# Altium project New_SSA.PrjPcb
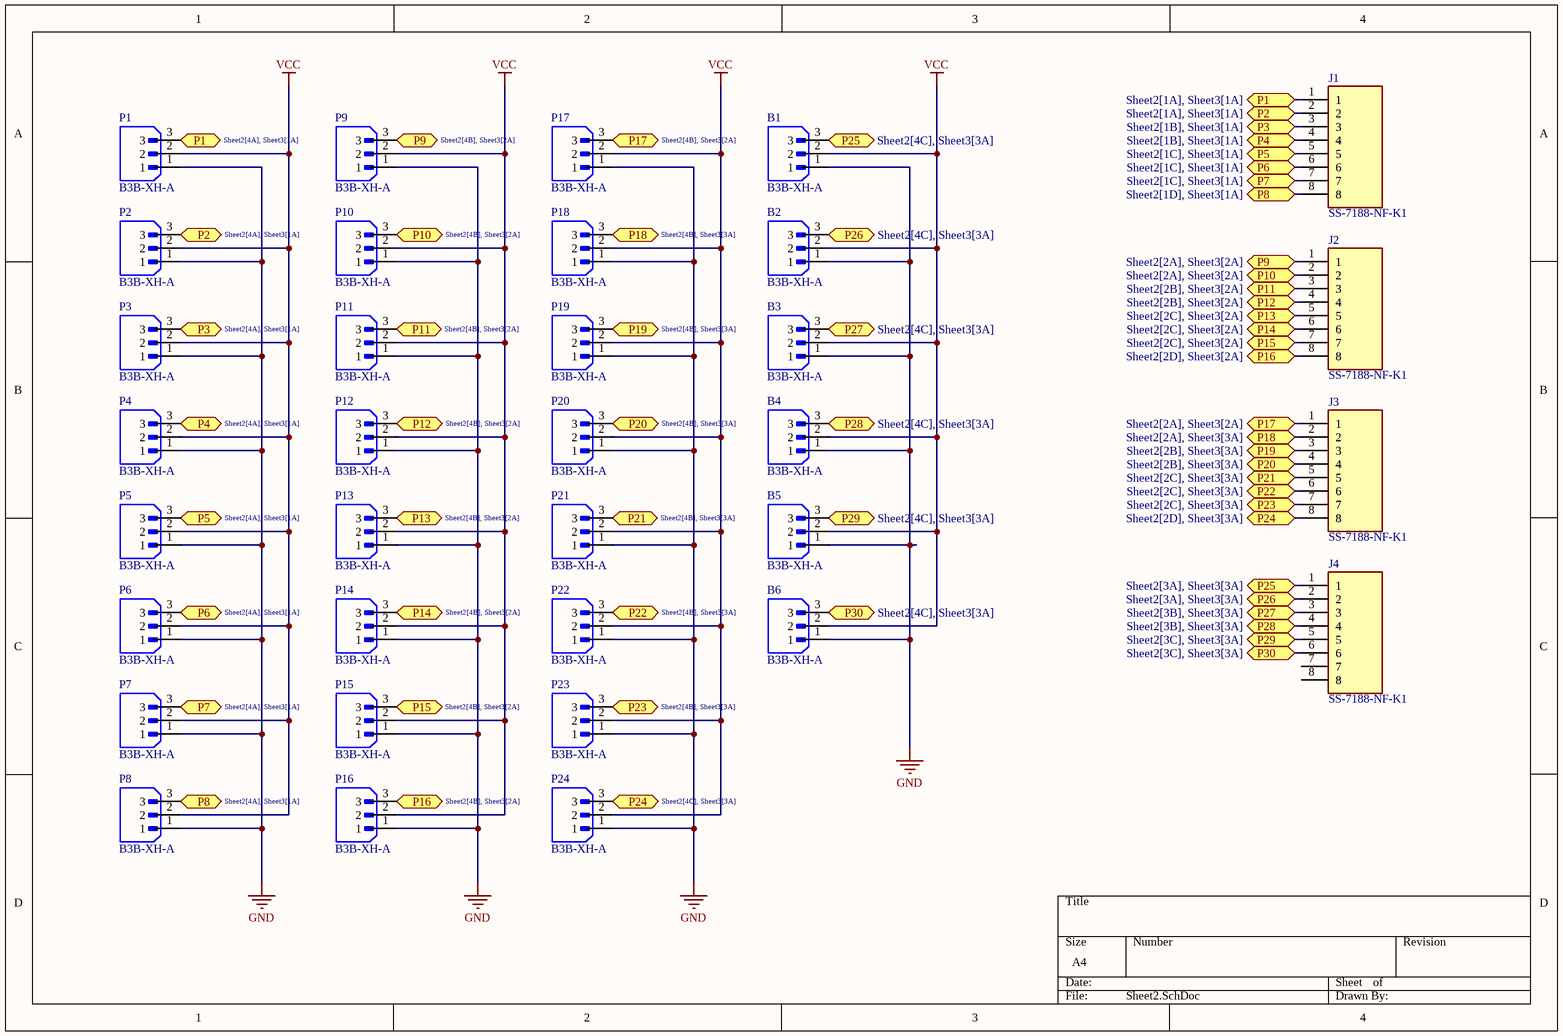
[diagram p0: Sheet2.SchDoc]
2 sheets, 40 parts. Net scope: flat (ports and power ports of the same name join across sheets).
Board file: PCB4.PcbDoc
Sheets:
  Sheet2.SchDoc
  Sheet3.SchDoc

## Sheet Sheet2.SchDoc
size A4; SheetNumber: 1; SheetTotal: 2

### Parts
B1  B3B-XH-A  [JST_B3B-XH-A]
B2  B3B-XH-A  [JST_B3B-XH-A]
B3  B3B-XH-A  [JST_B3B-XH-A]
B4  B3B-XH-A  [JST_B3B-XH-A]
B5  B3B-XH-A  [JST_B3B-XH-A]
B6  B3B-XH-A  [JST_B3B-XH-A]
J1  SS-7188-NF-K1  [BEL_SS-7188-NF-K1]
J2  SS-7188-NF-K1  [BEL_SS-7188-NF-K1]
J3  SS-7188-NF-K1  [BEL_SS-7188-NF-K1]
J4  SS-7188-NF-K1  [BEL_SS-7188-NF-K1]
P1  B3B-XH-A  [JST_B3B-XH-A]
P2  B3B-XH-A  [JST_B3B-XH-A]
P3  B3B-XH-A  [JST_B3B-XH-A]
P4  B3B-XH-A  [JST_B3B-XH-A]
P5  B3B-XH-A  [JST_B3B-XH-A]
P6  B3B-XH-A  [JST_B3B-XH-A]
P7  B3B-XH-A  [JST_B3B-XH-A]
P8  B3B-XH-A  [JST_B3B-XH-A]
P9  B3B-XH-A  [JST_B3B-XH-A]
P10  B3B-XH-A  [JST_B3B-XH-A]
P11  B3B-XH-A  [JST_B3B-XH-A]
P12  B3B-XH-A  [JST_B3B-XH-A]
P13  B3B-XH-A  [JST_B3B-XH-A]
P14  B3B-XH-A  [JST_B3B-XH-A]
P15  B3B-XH-A  [JST_B3B-XH-A]
P16  B3B-XH-A  [JST_B3B-XH-A]
P17  B3B-XH-A  [JST_B3B-XH-A]
P18  B3B-XH-A  [JST_B3B-XH-A]
P19  B3B-XH-A  [JST_B3B-XH-A]
P20  B3B-XH-A  [JST_B3B-XH-A]
P21  B3B-XH-A  [JST_B3B-XH-A]
P22  B3B-XH-A  [JST_B3B-XH-A]
P23  B3B-XH-A  [JST_B3B-XH-A]
P24  B3B-XH-A  [JST_B3B-XH-A]

### Ports
P1 (bidir, see Sheet2[1A], Sheet3[1A]), P1 (bidir, see Sheet2[4A], Sheet3[1A]), P2 (bidir, see Sheet2[1A], Sheet3[1A]), P2 (bidir, see Sheet2[4A], Sheet3[1A]), P3 (bidir, see Sheet2[1B], Sheet3[1A]), P3 (bidir, see Sheet2[4A], Sheet3[1A]), P4 (bidir, see Sheet2[1B], Sheet3[1A]), P4 (bidir, see Sheet2[4A], Sheet3[1A]), P5 (bidir, see Sheet2[1C], Sheet3[1A]), P5 (bidir, see Sheet2[4A], Sheet3[1A]), P6 (bidir, see Sheet2[1C], Sheet3[1A]), P6 (bidir, see Sheet2[4A], Sheet3[1A]), P7 (bidir, see Sheet2[1C], Sheet3[1A]), P7 (bidir, see Sheet2[4A], Sheet3[1A]), P8 (bidir, see Sheet2[1D], Sheet3[1A]), P8 (bidir, see Sheet2[4A], Sheet3[1A]), P9 (bidir, see Sheet2[2A], Sheet3[2A]), P9 (bidir, see Sheet2[4B], Sheet3[2A]), P10 (bidir, see Sheet2[2A], Sheet3[2A]), P10 (bidir, see Sheet2[4B], Sheet3[2A]), P11 (bidir, see Sheet2[2B], Sheet3[2A]), P11 (bidir, see Sheet2[4B], Sheet3[2A]), P12 (bidir, see Sheet2[2B], Sheet3[2A]), P12 (bidir, see Sheet2[4B], Sheet3[2A]), P13 (bidir, see Sheet2[2C], Sheet3[2A]), P13 (bidir, see Sheet2[4B], Sheet3[2A]), P14 (bidir, see Sheet2[2C], Sheet3[2A]), P14 (bidir, see Sheet2[4B], Sheet3[2A]), P15 (bidir, see Sheet2[2C], Sheet3[2A]), P15 (bidir, see Sheet2[4B], Sheet3[2A]), P16 (bidir, see Sheet2[2D], Sheet3[2A]), P16 (bidir, see Sheet2[4B], Sheet3[2A]), P17 (bidir, see Sheet2[2A], Sheet3[2A]), P17 (bidir, see Sheet2[4B], Sheet3[2A]), P18 (bidir, see Sheet2[2A], Sheet3[3A]), P18 (bidir, see Sheet2[4B], Sheet3[3A]), P19 (bidir, see Sheet2[2B], Sheet3[3A]), P19 (bidir, see Sheet2[4B], Sheet3[3A]), P20 (bidir, see Sheet2[2B], Sheet3[3A]), P20 (bidir, see Sheet2[4B], Sheet3[3A]), P21 (bidir, see Sheet2[2C], Sheet3[3A]), P21 (bidir, see Sheet2[4B], Sheet3[3A]), P22 (bidir, see Sheet2[2C], Sheet3[3A]), P22 (bidir, see Sheet2[4B], Sheet3[3A]), P23 (bidir, see Sheet2[2C], Sheet3[3A]), P23 (bidir, see Sheet2[4B], Sheet3[3A]), P24 (bidir, see Sheet2[2D], Sheet3[3A]), P24 (bidir, see Sheet2[4C], Sheet3[3A]), P25 (bidir, see Sheet2[3A], Sheet3[3A]), P25 (bidir, see Sheet2[4C], Sheet3[3A]), P26 (bidir, see Sheet2[3A], Sheet3[3A]), P26 (bidir, see Sheet2[4C], Sheet3[3A]), P27 (bidir, see Sheet2[3B], Sheet3[3A]), P27 (bidir, see Sheet2[4C], Sheet3[3A]), P28 (bidir, see Sheet2[3B], Sheet3[3A]), P28 (bidir, see Sheet2[4C], Sheet3[3A]), P29 (bidir, see Sheet2[3C], Sheet3[3A]), P29 (bidir, see Sheet2[4C], Sheet3[3A]), P30 (bidir, see Sheet2[3C], Sheet3[3A]), P30 (bidir, see Sheet2[4C], Sheet3[3A])

### Nets
GND: B1.1 B2.1 B3.1 B4.1 B5.1 B6.1 P1.1 P2.1 P3.1 P4.1 P5.1 P6.1 P7.1 P8.1 P9.1 P10.1 P11.1 P12.1 P13.1 P14.1 P15.1 P16.1 P17.1 P18.1 P19.1 P20.1 P21.1 P22.1 P23.1 P24.1
VCC: B1.2 B2.2 B3.2 B4.2 B5.2 B6.2 P1.2 P2.2 P3.2 P4.2 P5.2 P6.2 P7.2 P8.2 P9.2 P10.2 P11.2 P12.2 P13.2 P14.2 P15.2 P16.2 P17.2 P18.2 P19.2 P20.2 P21.2 P22.2 P23.2 P24.2
NetB1_3: B1.3 J4.1 ; port P25
NetB2_3: B2.3 J4.2 ; port P26
NetB3_3: B3.3 J4.3 ; port P27
NetB4_3: B4.3 J4.4 ; port P28
NetB5_3: B5.3 J4.5 ; port P29
NetB6_3: B6.3 J4.6 ; port P30
NetH1_2: J1.1 P1.3 ; port P1
NetH1_3: J1.2 P2.3 ; port P2
NetH1_4: J1.3 P3.3 ; port P3
NetH1_5: J1.4 P4.3 ; port P4
NetH1_6: J1.5 P5.3 ; port P5
NetH1_7: J1.6 P6.3 ; port P6
NetH1_8: J1.7 P7.3 ; port P7
NetH1_9: J1.8 P8.3 ; port P8
NetH2_1: J2.1 P9.3 ; port P9
NetH2_2: J2.2 P10.3 ; port P10
NetH2_3: J2.3 P11.3 ; port P11
NetH2_4: J2.4 P12.3 ; port P12
NetH2_5: J2.5 P13.3 ; port P13
NetH2_6: J2.6 P14.3 ; port P14
NetH2_7: J2.7 P15.3 ; port P15
NetH2_8: J2.8 P16.3 ; port P16
NetH2_9: J3.1 P17.3 ; port P17
NetH3_1: J3.2 P18.3 ; port P18
NetH3_2: J3.3 P19.3 ; port P19
NetH3_3: J3.4 P20.3 ; port P20
NetH3_4: J3.5 P21.3 ; port P21
NetH3_5: J3.6 P22.3 ; port P22
NetH3_6: J3.7 P23.3 ; port P23
NetH3_7: J3.8 P24.3 ; port P24

Not connected (* = marked no-connect by the designer): J4 7 8

### Library data of the parts
B1-B6 P1-P24 = B3B-XH-A: Connector Header Through Hole 3 position 0.098 (2.50mm); MF: JST Sales; SnapEDA_Link: https://www.snapeda.com/parts/B3B-XH-A/JST+Sales+America+Inc./view-part/?ref=snap; Package: None; Value: *; MP: B3B-XH-A; Check_prices: https://www.snapeda.com/parts/B3B-XH-A/JST+Sales+America+Inc./view-part/?ref=eda
J1-J4 = SS-7188-NF-K1: Conn Modular Jack F 8 POS 2.54mm Solder RA Thru-Hole 8 Terminal 1 Port Cat 5; Package: None; Price: None; Value: *; MP: SS-7188-NF-K1; Availability: Unavailable

## Sheet Sheet3.SchDoc
size A4; SheetNumber: 2; SheetTotal: 2
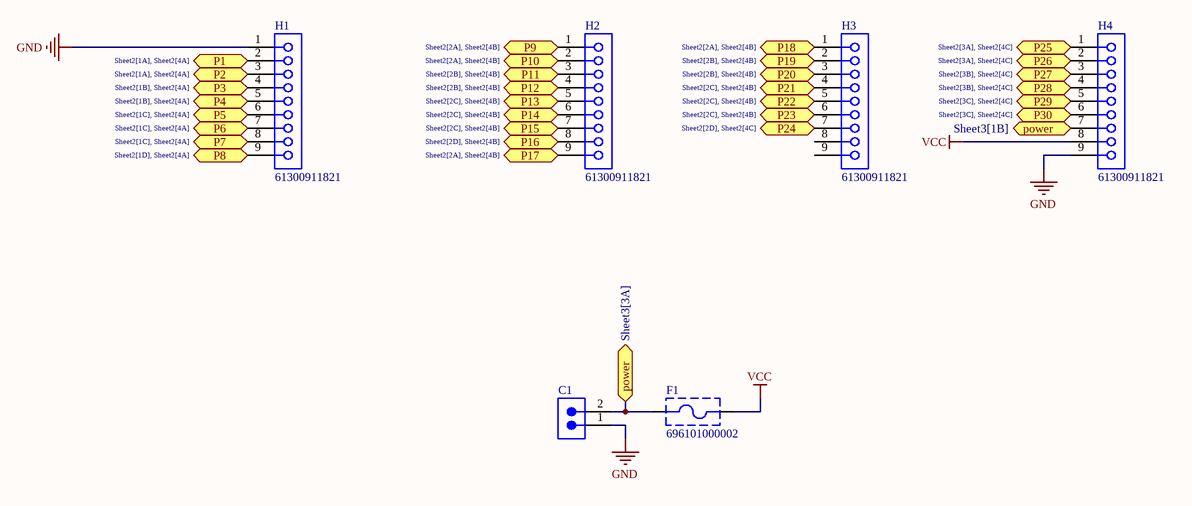
[diagram p1: Sheet3.SchDoc]

### Parts
C1  691313510002  [691313510002]  (value not drawn)
F1  696101000002  [696101000002]
H1  61300911821  [61300911821]
H2  61300911821  [61300911821]
H3  61300911821  [61300911821]
H4  61300911821  [61300911821]

### Ports
P1 (bidir, see Sheet2[1A], Sheet2[4A]), P2 (bidir, see Sheet2[1A], Sheet2[4A]), P3 (bidir, see Sheet2[1B], Sheet2[4A]), P4 (bidir, see Sheet2[1B], Sheet2[4A]), P5 (bidir, see Sheet2[1C], Sheet2[4A]), P6 (bidir, see Sheet2[1C], Sheet2[4A]), P7 (bidir, see Sheet2[1C], Sheet2[4A]), P8 (bidir, see Sheet2[1D], Sheet2[4A]), P9 (bidir, see Sheet2[2A], Sheet2[4B]), P10 (bidir, see Sheet2[2A], Sheet2[4B]), P11 (bidir, see Sheet2[2B], Sheet2[4B]), P12 (bidir, see Sheet2[2B], Sheet2[4B]), P13 (bidir, see Sheet2[2C], Sheet2[4B]), P14 (bidir, see Sheet2[2C], Sheet2[4B]), P15 (bidir, see Sheet2[2C], Sheet2[4B]), P16 (bidir, see Sheet2[2D], Sheet2[4B]), P17 (bidir, see Sheet2[2A], Sheet2[4B]), P18 (bidir, see Sheet2[2A], Sheet2[4B]), P19 (bidir, see Sheet2[2B], Sheet2[4B]), P20 (bidir, see Sheet2[2B], Sheet2[4B]), P21 (bidir, see Sheet2[2C], Sheet2[4B]), P22 (bidir, see Sheet2[2C], Sheet2[4B]), P23 (bidir, see Sheet2[2C], Sheet2[4B]), P24 (bidir, see Sheet2[2D], Sheet2[4C]), P25 (bidir, see Sheet2[3A], Sheet2[4C]), P26 (bidir, see Sheet2[3A], Sheet2[4C]), P27 (bidir, see Sheet2[3B], Sheet2[4C]), P28 (bidir, see Sheet2[3B], Sheet2[4C]), P29 (bidir, see Sheet2[3C], Sheet2[4C]), P30 (bidir, see Sheet2[3C], Sheet2[4C]), power (bidir, see Sheet3[1B]), power (bidir, see Sheet3[3A])

### Nets
GND: C1.1 H1.1 H4.9
VCC: F1.2 H4.8
NetB1_3: H4.1 ; port P25
NetB2_3: H4.2 ; port P26
NetB3_3: H4.3 ; port P27
NetB4_3: H4.4 ; port P28
NetB5_3: H4.5 ; port P29
NetB6_3: H4.6 ; port P30
NetC1_2: C1.2 F1.1 H4.7 ; port power
NetH1_2: H1.2 ; port P1
NetH1_3: H1.3 ; port P2
NetH1_4: H1.4 ; port P3
NetH1_5: H1.5 ; port P4
NetH1_6: H1.6 ; port P5
NetH1_7: H1.7 ; port P6
NetH1_8: H1.8 ; port P7
NetH1_9: H1.9 ; port P8
NetH2_1: H2.1 ; port P9
NetH2_2: H2.2 ; port P10
NetH2_3: H2.3 ; port P11
NetH2_4: H2.4 ; port P12
NetH2_5: H2.5 ; port P13
NetH2_6: H2.6 ; port P14
NetH2_7: H2.7 ; port P15
NetH2_8: H2.8 ; port P16
NetH2_9: H2.9 ; port P17
NetH3_1: H3.1 ; port P18
NetH3_2: H3.2 ; port P19
NetH3_3: H3.3 ; port P20
NetH3_4: H3.4 ; port P21
NetH3_5: H3.5 ; port P22
NetH3_6: H3.6 ; port P23
NetH3_7: H3.7 ; port P24

Not connected (* = marked no-connect by the designer): H3 8 9

### Library data of the parts
C1 = CMP-1502-02192-3: 313; 5.08MM Pitch Straight Pluggable Term Block, Pcb Header, Through Hole, 2 Way; Number of Contacts: 2; Voltage: 300V; Number of Levels: 1; Color: Green; Gender: Male; Current: 20A; Pitch: 5.08mm; Number of Pins: 2; RoHS: Compliant; Length: 11.5mm; Width: 12.16mm; Packaging: Box; Max Operating Temperature: 105°C; Lead Pitch: 5.08mm; Mount: Through Hole; Number of Rows: 1; Voltage Rating: 300V; Contact Material: Tin; Height: 8.7mm; Contact Plating: Tin; Termination: Solder; Min Operating Temperature: -40°C; Number of Positions Per Level: 2; Current Rating: 20A
F1 = CMP-1502-00233-4: WR-FSH Fuse Holder Blocks Fuse Holder Blocks Clip Cover for PCB; Fuse Current: 10A; Voltage Rating (AC): 250V; Mount: Through Hole; REACH SVHC: Unknown; RoHS: Compliant; Height: 13.6mm; Packaging: Box; Min Operating Temperature: -30°C; Max Operating Temperature: 120°C
H1-H4 = CMP-1502-01331-4: THT Vertical Socket Header WR-PHD, Pitch 2.54 mm, Single Row, 9 pins; Gender: Female; Operating Supply Voltage: 250V; Contact Resistance: 20mΩ; Current Rating: 3A; Number of Pins: 9; Lead Pitch: 2.54mm; Orientation: Vertical

## Nets that join several sheets
GND: Sheet2 (30 pins), Sheet3 (C1.1 H1.1 H4.9)
VCC: Sheet2 (30 pins), Sheet3 (F1.2 H4.8)
NetB1_3: Sheet2 (B1.3 J4.1), Sheet3 (H4.1)
NetB2_3: Sheet2 (B2.3 J4.2), Sheet3 (H4.2)
NetB3_3: Sheet2 (B3.3 J4.3), Sheet3 (H4.3)
NetB4_3: Sheet2 (B4.3 J4.4), Sheet3 (H4.4)
NetB5_3: Sheet2 (B5.3 J4.5), Sheet3 (H4.5)
NetB6_3: Sheet2 (B6.3 J4.6), Sheet3 (H4.6)
NetH1_2: Sheet2 (J1.1 P1.3), Sheet3 (H1.2)
NetH1_3: Sheet2 (J1.2 P2.3), Sheet3 (H1.3)
NetH1_4: Sheet2 (J1.3 P3.3), Sheet3 (H1.4)
NetH1_5: Sheet2 (J1.4 P4.3), Sheet3 (H1.5)
NetH1_6: Sheet2 (J1.5 P5.3), Sheet3 (H1.6)
NetH1_7: Sheet2 (J1.6 P6.3), Sheet3 (H1.7)
NetH1_8: Sheet2 (J1.7 P7.3), Sheet3 (H1.8)
NetH1_9: Sheet2 (J1.8 P8.3), Sheet3 (H1.9)
NetH2_1: Sheet2 (J2.1 P9.3), Sheet3 (H2.1)
NetH2_2: Sheet2 (J2.2 P10.3), Sheet3 (H2.2)
NetH2_3: Sheet2 (J2.3 P11.3), Sheet3 (H2.3)
NetH2_4: Sheet2 (J2.4 P12.3), Sheet3 (H2.4)
NetH2_5: Sheet2 (J2.5 P13.3), Sheet3 (H2.5)
NetH2_6: Sheet2 (J2.6 P14.3), Sheet3 (H2.6)
NetH2_7: Sheet2 (J2.7 P15.3), Sheet3 (H2.7)
NetH2_8: Sheet2 (J2.8 P16.3), Sheet3 (H2.8)
NetH2_9: Sheet2 (J3.1 P17.3), Sheet3 (H2.9)
NetH3_1: Sheet2 (J3.2 P18.3), Sheet3 (H3.1)
NetH3_2: Sheet2 (J3.3 P19.3), Sheet3 (H3.2)
NetH3_3: Sheet2 (J3.4 P20.3), Sheet3 (H3.3)
NetH3_4: Sheet2 (J3.5 P21.3), Sheet3 (H3.4)
NetH3_5: Sheet2 (J3.6 P22.3), Sheet3 (H3.5)
NetH3_6: Sheet2 (J3.7 P23.3), Sheet3 (H3.6)
NetH3_7: Sheet2 (J3.8 P24.3), Sheet3 (H3.7)